# EAGLE design IOIO (EAGLE 6.3)
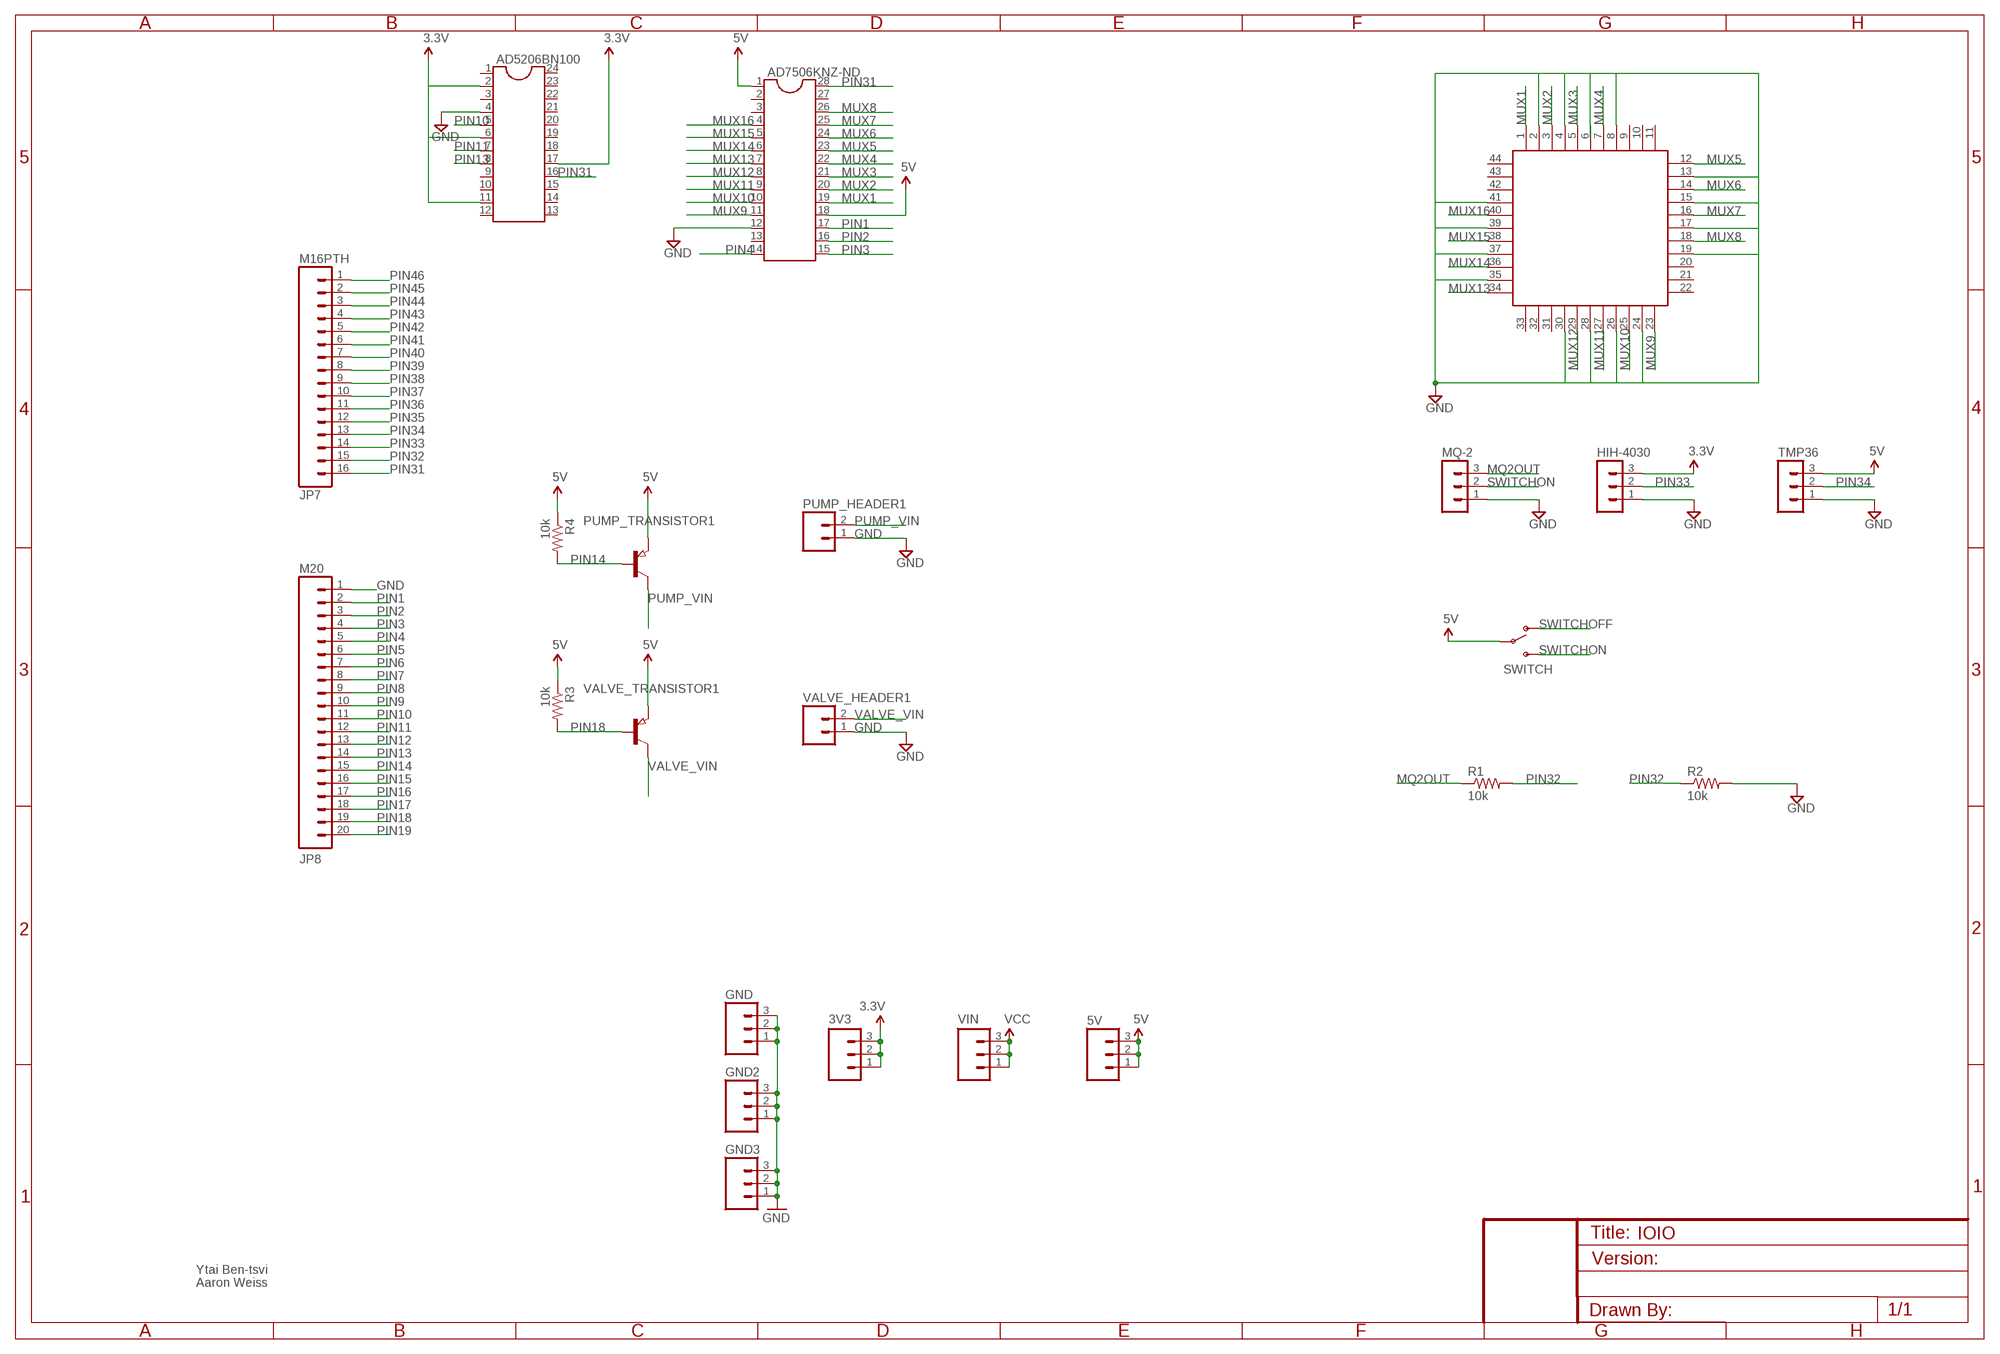
[diagram p0: schematic, sheet 1]

## Parts
3V3  M03PTH  [1X03]
5V  M03PTH  [1X03]
AD5206BN100  DIL24-3  [DIL24-3]
AD7506KNZ-ND  DIL28  [DIL28-6]
GND  M03PTH  [1X03]
GND2  M03PTH  [1X03]
GND3  M03PTH  [1X03]
HIH-4030  MA03-1  [MA03-1]
JP7  M16PTH  [1X16]
JP8  M20  [1X20]
MQ-2  MA03-1  [MA03-1]
PUMP_HEADER1  M02PTH  [1X02]
PUMP_TRANSISTOR1  PNP-TRANSISTOR_SOT23  [SOT23]
R1  10k  R-US_0207/7  [0207/7]
R2  10k  R-US_0207/7  [0207/7]
R3  10k  R-US_M2012  [M2012]
R4  10k  R-US_M2012  [M2012]
SWITCH  SWITCH-SPSTPTH  [SWITCH-SPDT]
TMP36  MA03-1  [MA03-1]
U$1  S44  [S44]
VALVE_HEADER1  M02PTH  [1X02]
VALVE_TRANSISTOR1  PNP-TRANSISTOR_SOT23  [SOT23]
VIN  M03PTH  [1X03]

## Nets
3.3V: 3V3.1 3V3.2 3V3.3 AD5206BN100.2 AD5206BN100.6 AD5206BN100.11 AD5206BN100.17 HIH-4030.3
5V: 5V.1 5V.2 5V.3 AD7506KNZ-ND.1 AD7506KNZ-ND.18 PUMP_TRANSISTOR1.2(E) R3.1 R4.1 SWITCH.2(P) TMP36.3 VALVE_TRANSISTOR1.2(E)
GND: AD5206BN100.4 AD7506KNZ-ND.12 GND2.1 GND2.2 GND2.3 GND3.1 GND3.2 GND3.3 GND.1 GND.2 GND.3 HIH-4030.1 JP8.1 MQ-2.1 PUMP_HEADER1.1 R2.2 TMP36.1 U$1.2 U$1.4 U$1.8 U$1.13 U$1.15 U$1.17 U$1.19 U$1.24 U$1.26 U$1.28 U$1.30 U$1.35 U$1.37 U$1.39 U$1.41 VALVE_HEADER1.1
MQ2OUT: MQ-2.3 R1.1
MUX1: AD7506KNZ-ND.19 U$1.1
MUX2: AD7506KNZ-ND.20 U$1.3
MUX3: AD7506KNZ-ND.21 U$1.5
MUX4: AD7506KNZ-ND.22 U$1.7
MUX5: AD7506KNZ-ND.23 U$1.12
MUX6: AD7506KNZ-ND.24 U$1.14
MUX7: AD7506KNZ-ND.25 U$1.16
MUX8: AD7506KNZ-ND.26 U$1.18
MUX9: AD7506KNZ-ND.11 U$1.23
MUX10: AD7506KNZ-ND.10 U$1.25
MUX11: AD7506KNZ-ND.9 U$1.27
MUX12: AD7506KNZ-ND.8 U$1.29
MUX13: AD7506KNZ-ND.7 U$1.34
MUX14: AD7506KNZ-ND.6 U$1.36
MUX15: AD7506KNZ-ND.5 U$1.38
MUX16: AD7506KNZ-ND.4 U$1.40
PIN1: AD7506KNZ-ND.17 JP8.2
PIN2: AD7506KNZ-ND.16 JP8.3
PIN3: AD7506KNZ-ND.15 JP8.4
PIN4: AD7506KNZ-ND.14 JP8.5
PIN5: JP8.6
PIN6: JP8.7
PIN7: JP8.8
PIN8: JP8.9
PIN9: JP8.10
PIN10: AD5206BN100.5 JP8.11
PIN11: AD5206BN100.7 JP8.12
PIN12: JP8.13
PIN13: AD5206BN100.8 JP8.14
PIN14: JP8.15 PUMP_TRANSISTOR1.1(B) R4.2
PIN15: JP8.16
PIN16: JP8.17
PIN17: JP8.18
PIN18: JP8.19 R3.2 VALVE_TRANSISTOR1.1(B)
PIN19: JP8.20
PIN31: AD5206BN100.16 AD7506KNZ-ND.28 JP7.16
PIN32: JP7.15 R1.2 R2.1
PIN33: HIH-4030.2 JP7.14
PIN34: JP7.13 TMP36.2
PIN35: JP7.12
PIN36: JP7.11
PIN37: JP7.10
PIN38: JP7.9
PIN39: JP7.8
PIN40: JP7.7
PIN41: JP7.6
PIN42: JP7.5
PIN43: JP7.4
PIN44: JP7.3
PIN45: JP7.2
PIN46: JP7.1
PUMP_VIN: PUMP_HEADER1.2 PUMP_TRANSISTOR1.3(C)
SWITCHOFF: SWITCH.1(O)
SWITCHON: MQ-2.2 SWITCH.3(S)
VALVE_VIN: VALVE_HEADER1.2 VALVE_TRANSISTOR1.3(C)
VCC: VIN.1 VIN.2 VIN.3
Unconnected: AD5206BN100.1 AD5206BN100.3 AD5206BN100.9 AD5206BN100.10 AD5206BN100.12 AD5206BN100.13 AD5206BN100.14 AD5206BN100.15 AD5206BN100.18 AD5206BN100.19 AD5206BN100.20 AD5206BN100.21 AD5206BN100.22 AD5206BN100.23 AD5206BN100.24 AD7506KNZ-ND.2 AD7506KNZ-ND.3 AD7506KNZ-ND.13 AD7506KNZ-ND.27 U$1.6 U$1.9 U$1.10 U$1.11 U$1.20 U$1.21 U$1.22 U$1.31 U$1.32 U$1.33 U$1.42 U$1.43 U$1.44

## Notes on the sheet
- Ytai Ben-tsvi
- Aaron Weiss

## Library data of the parts
3V3 5V GND GND2 GND3 VIN = SparkFun:M03: Header 3 Standard 3-pin 0.1" header. Use with straight break away headers (SKU : PRT-00116), right angle break away headers (PRT-00553), swiss pins (PRT-00743), machine pins (PRT-00117), and female headers (PRT-00115). Molex polarized connector foot print use with SKU : PRT-08232 with associated crimp pins and housings.
AD5206BN100 = ic-package:DIL24: Dual In Line
AD7506KNZ-ND = ic-package:DIL28: Dual In Line
HIH-4030 MQ-2 TMP36 = con-lstb:MA03-1: PIN HEADER; OC_FARNELL: unknown; OC_NEWARK: unknown
JP7 = SparkFun-Connectors:M16: 1x16 .1" header
JP8 = SparkFun-Connectors:M20: 1x20 .1" header This is just like the LOCK variant in that the holes are staggared by 5 mil, but except for the last two holes. They are not altered from the "standard" footprint layout. This is used for a special purpose on the layout of our Graphic LCD Backpack. Make sure you want to use this device before selecting it for you project!
PUMP_HEADER1 VALVE_HEADER1 = SparkFun:M02: Header 2 Standard 2-pin 0.1" header. Use with straight break away headers (SKU : PRT-00116), right angle break away headers (PRT-00553), swiss pins (PRT-00743), machine pins (PRT-00117), and female headers (PRT-00115). Molex polarized connector foot print use with SKU : PRT-08233 with associated crimp pins and housings.
PUMP_TRANSISTOR1 VALVE_TRANSISTOR1 = semicon-smd-ipc:PNP-TRANSISTOR_: PNP TRANSISTOR
R1-R4 = rcl:R-US_: RESISTOR, American symbol
SWITCH = SparkFun:SWITCH-SPST: SPST Switch Simple slide switch. Spark Fun Electronics SKU : COM-00102
U$1 = plcc-socket:S44: 44-pin PLCC through-hole socket

## Board
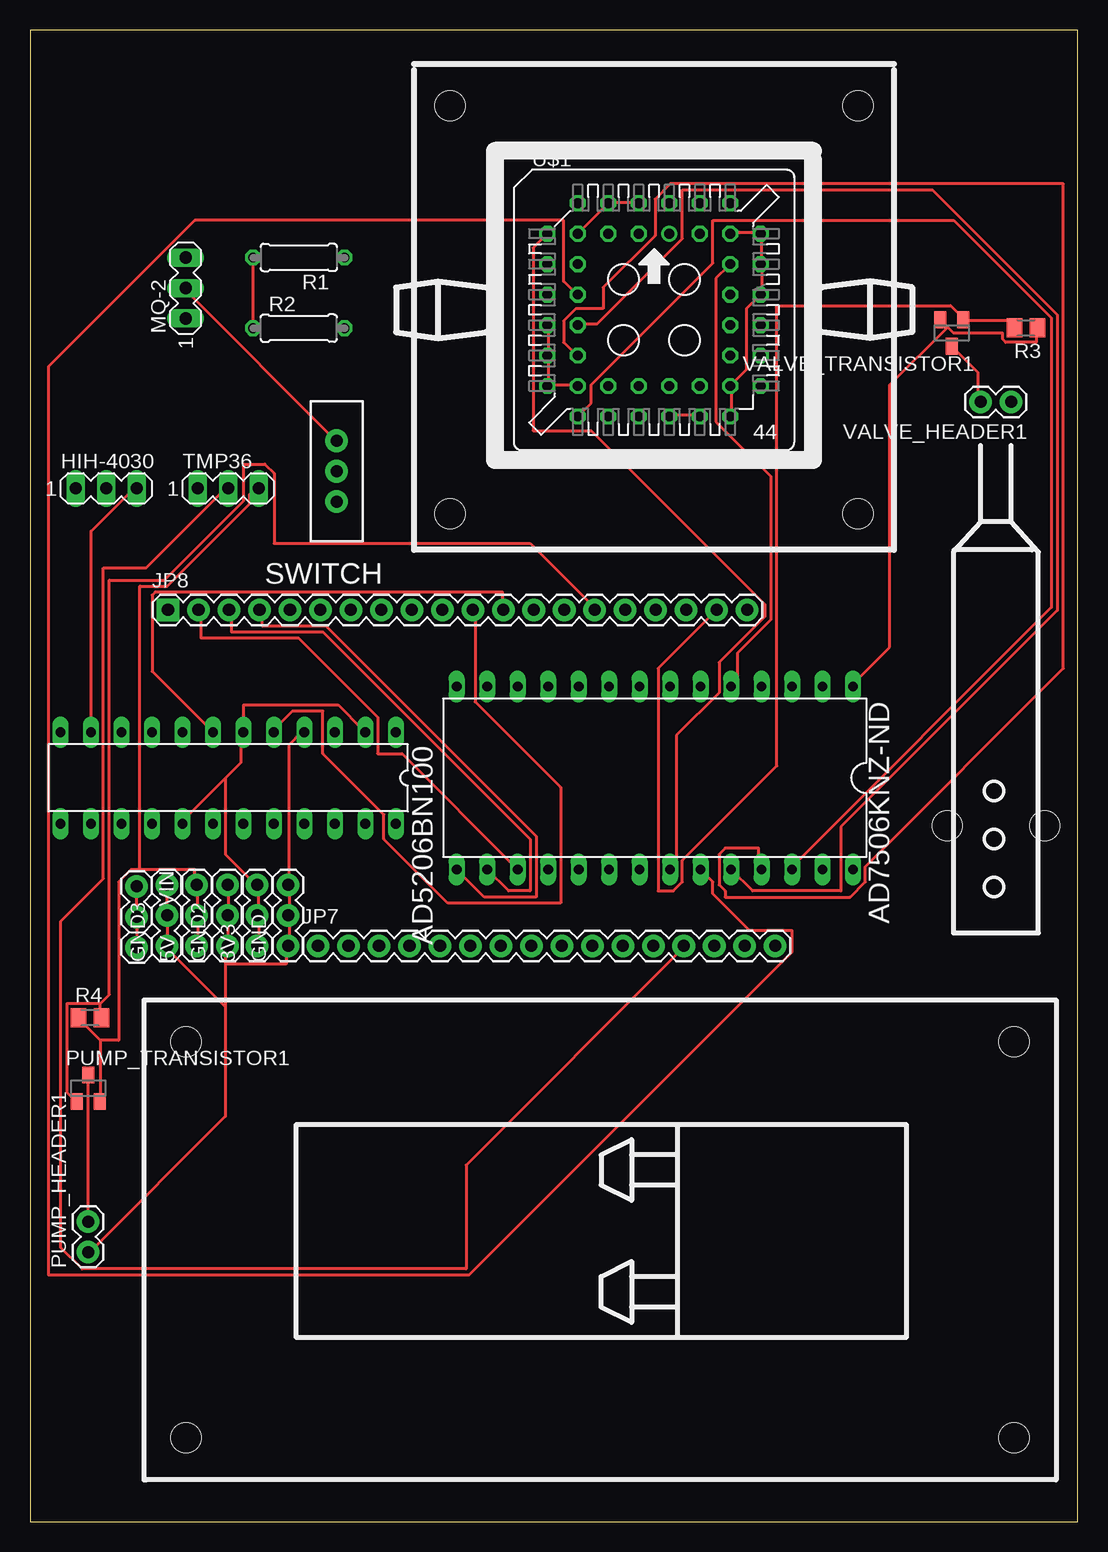
[diagram p1: board, top side]
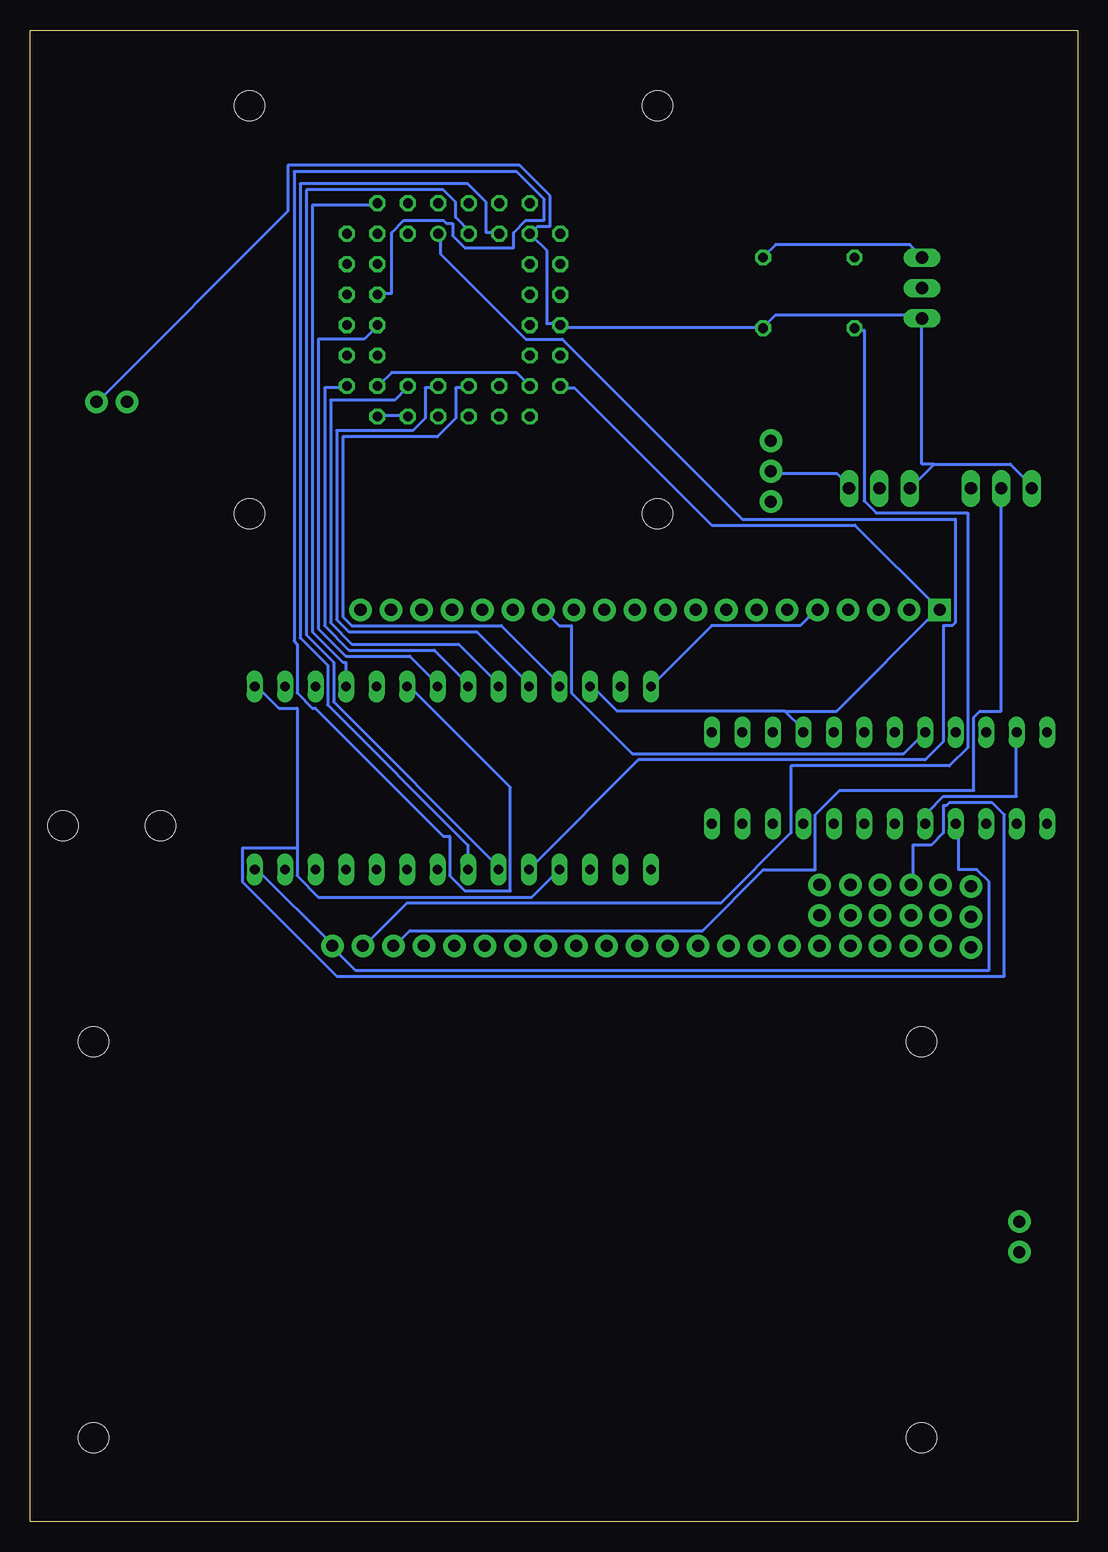
[diagram p2: board, bottom side, seen from below]

Size 87.3 x 124.32 mm. Coordinates in mm from the lower left corner, seen from the top.
Outline: 0,0 87.3,0 87.3,124.32 0,124.32 0,0
Copper layers (1*16): Top 0.035mm / dielectric 1.5mm / Bottom 0.035mm
Design rules "default": minimum track width 10mil, minimum drill 24mil, track to track 8mil, track to pad 8mil, pad to pad 8mil, via to via 8mil, smd to smd 8mil, copper to edge 40mil, drill to drill 8mil, minimum pad ring 10mil, minimum via ring 8mil, stop-mask expansion 4mil, vias tented up to drill 0mil, thermal gap 10mil
Holes 2.5 mm at 84.55,58 76.43,58 35,118 69,118 69,84 35,84 82,40 82,7 13,7 13,40

### Footprints (pad centres in the part's own frame; a part is rotated, then mirrored left to right if it is on the bottom)
1X03 = drill 1.016 pad 1.88: 1 0,0; 2 2.54,0; 3 5.08,0
DIL24-3 = drill 0.813 long: 1 -13.97,-3.81; 2 -11.43,-3.81; 3 -8.89,-3.81; 4 -6.35,-3.81; 5 -3.81,-3.81; 6 -1.27,-3.81; 7 1.27,-3.81; 8 3.81,-3.81; 9 6.35,-3.81; 10 8.89,-3.81; 11 11.43,-3.81; 12 13.97,-3.81; 13 13.97,3.81; 14 11.43,3.81; 15 8.89,3.81; 16 6.35,3.81; 17 3.81,3.81; 18 1.27,3.81; 19 -1.27,3.81; 20 -3.81,3.81; 21 -6.35,3.81; 22 -8.89,3.81; 23 -11.43,3.81; 24 -13.97,3.81
DIL28-6 = drill 0.813 long: 1 -16.51,-7.62; 2 -13.97,-7.62; 3 -11.43,-7.62; 4 -8.89,-7.62; 5 -6.35,-7.62; 6 -3.81,-7.62; 7 -1.27,-7.62; 8 1.27,-7.62; 9 3.81,-7.62; 10 6.35,-7.62; 11 8.89,-7.62; 12 11.43,-7.62; 13 13.97,-7.62; 14 16.51,-7.62; 15 16.51,7.62; 16 13.97,7.62; 17 11.43,7.62; 18 8.89,7.62; 19 6.35,7.62; 20 3.81,7.62; 21 1.27,7.62; 22 -1.27,7.62; 23 -3.81,7.62; 24 -6.35,7.62; 25 -8.89,7.62; 26 -11.43,7.62; 27 -13.97,7.62; 28 -16.51,7.62
MA03-1 = drill 1.016 long: 1 -2.54,0; 2 0,0; 3 2.54,0
1X16 = drill 1.016 pad 1.88: 1 0,0; 2 2.54,0; 3 5.08,0; 4 7.62,0; 5 10.16,0; 6 12.7,0; 7 15.24,0; 8 17.78,0; 9 20.32,0; 10 22.86,0; 11 25.4,0; 12 27.94,0; 13 30.48,0; 14 33.02,0; 15 35.56,0; 16 38.1,0
1X20 = drill 1.016 pad 1.88 square: 1 0,0 | drill 1.016 pad 1.88: 2 2.54,0; 3 5.08,0; 4 7.62,0; 5 10.16,0; 6 12.7,0; 7 15.24,0; 8 17.78,0; 9 20.32,0; 10 22.86,0; 11 25.4,0; 12 27.94,0; 13 30.48,0; 14 33.02,0; 15 35.56,0; 16 38.1,0; 17 40.64,0; 18 43.18,0; 19 45.72,0; 20 48.26,0
1X02 = drill 1.016 pad 1.88: 1 0,0; 2 2.54,0
SOT23 = smd 1 x 1.4: 1 -0.95,-1.1; 2 0.95,-1.1; 3 0,1.1
0207/7 = drill 0.813 octagon: 1 -3.81,0; 2 3.81,0
M2012 = smd 1.3 x 1.6: 1 -0.95,0; 2 0.95,0
SWITCH-SPDT = drill 1.016 pad 1.88: 1 0,2.54; 2 0,0; 3 0,-2.54
S44 = drill 0.813: 1 1.27,6.35 | drill 0.813 octagon: 2 -1.27,8.89; 3 -1.27,6.35; 4 -3.81,8.89; 5 -3.81,6.35; 6 -6.35,8.89; 7 -8.89,6.35; 8 -6.35,6.35; 9 -8.89,3.81; 10 -6.35,3.81; 11 -8.89,1.27; 12 -6.35,1.27; 13 -8.89,-1.27; 14 -6.35,-1.27; 15 -8.89,-3.81; 16 -6.35,-3.81; 17 -8.89,-6.35; 18 -6.35,-8.89; 19 -6.35,-6.35; 20 -3.81,-8.89; 21 -3.81,-6.35; 22 -1.27,-8.89; 23 -1.27,-6.35; 24 1.27,-8.89; 25 1.27,-6.35; 26 3.81,-8.89; 27 3.81,-6.35; 28 6.35,-8.89; 29 8.89,-6.35; 30 6.35,-6.35; 31 8.89,-3.81; 32 6.35,-3.81; 33 8.89,-1.27; 34 6.35,-1.27; 35 8.89,1.27; 36 6.35,1.27; 37 8.89,3.81; 38 6.35,3.81; 39 8.89,6.35; 40 6.35,8.89; 41 6.35,6.35; 42 3.81,8.89; 43 3.81,6.35; 44 1.27,8.89

### Placement (x,y rotation side)
3V3  18.93,48 90 top
5V  13.89,48 90 top
AD5206BN100  16.51,61.99 180 top
AD7506KNZ-ND  52.07,61.99 180 top
GND  21.51,48 90 top
GND2  16.47,48 90 top
GND3  11.43,48 90 top
HIH-4030  6.35,86.12 0 top
JP7  24,48 0 top
JP8  11.5,76 0 top
MQ-2  12.97,102.82 90 top
PUMP_HEADER1  4.85,22.47 90 top
PUMP_TRANSISTOR1  4.85,36.13 0 top
R1  22.4,105.36 180 top
R2  22.4,99.47 0 top
R3  83,99.5 180 top
R4  5,42 0 top
SWITCH  25.56,87.55 180 top
TMP36  16.51,86.12 0 top
U$1  52,101 0 top
VALVE_HEADER1  81.76,93.33 180 top
VALVE_TRANSISTOR1  76.8,99.07 180 top
VIN  8.89,52.96 270 top

### Tracks (layer width: path | path; a pad name or v marks a point on that pad's centre or on a via)
3.3V
  Top 0.254: 3V3.1 19.07,48.01 19.07,50.29 3V3.2 19.07,50.55 19.07,52.83 3V3.3 18.81,53.09 16.27,55.63 16.27,61.98 | 16.27,61.98 17.54,63.25 17.54,65.79 AD5206BN100.6 17.8,66.04 17.8,68.07 25.67,68.07 27.7,66.04 AD5206BN100.2 | 16.27,61.98 12.72,58.42 AD5206BN100.17 | HIH-4030.3 8.65,86.11 5.1,82.55 5.1,66.04 AD5206BN100.11
  Bottom 0.254: AD5206BN100.11 5.1,65.79 5.1,60.45 11.19,60.45 12.46,59.18 12.46,58.42 AD5206BN100.17
5V
  Top 0.254: 5.86,40.13 5.86,35.05 PUMP_TRANSISTOR1.2 | 5.86,40.13 4.08,41.91 R4.1 | 5V.1 13.99,48.01 13.99,50.29 5V.2 13.99,50.55 13.99,52.83 5V.3 13.73,53.09 13.73,54.36 9.16,54.36 | 5.86,40.13 7.38,40.13 7.38,53.34 8.4,54.36 9.16,54.36 | 9.16,54.36 9.16,77.98 11.45,77.98 18.3,84.84 18.3,85.6 18.81,86.11 TMP36.3 | 76.47,99.57 76.98,99.06 81.04,99.06 81.04,98.55 81.3,98.3 83.84,98.3 83.84,99.31 R3.1 | 76.47,99.57 75.96,100.08 VALVE_TRANSISTOR1.2 | 76.47,99.57 71.64,94.74 71.64,72.9 68.6,69.85 AD7506KNZ-ND.1
  Bottom 0.254: TMP36.3 19.07,86.36 20.08,87.38 25.42,87.38 SWITCH.2 | 65.04,56.13 65.04,67.82 66.56,67.82 68.34,69.6 AD7506KNZ-ND.1 | 65.04,56.13 65.04,53.85 63.26,52.07 45.48,52.07 43.2,54.36 AD7506KNZ-ND.18 | 65.04,56.13 69.61,56.13 69.61,53.34 61.74,45.47 6.11,45.47 6.11,58.93 7.13,59.94 10.68,59.94 10.94,59.69 11.19,59.69 11.19,57.4 12.21,56.39 13.73,56.39 13.73,53.09 5V.3
GND
  Top 0.254: GND3.3 11.45,52.83 11.45,50.55 GND3.2 11.45,50.29 11.45,48.01 GND3.1 11.45,47.75 16.27,42.93 | GND2.3 16.53,52.83 16.53,50.55 GND2.2 16.53,50.29 16.53,48.01 GND2.1 16.27,47.75 16.27,46.48 | 16.27,46.48 16.27,42.93 | 16.27,42.93 16.27,33.78 5.1,22.61 PUMP_HEADER1.1 | AD5206BN100.4 22.62,65.79 21.61,64.77 21.61,53.09 GND.3 21.61,52.83 21.61,50.55 GND.2 21.61,50.29 21.61,48.01 GND.1 21.35,47.75 21.35,46.48 16.27,46.48 | U$1.8 45.74,107.44 48.02,109.73 U$1.4 48.28,109.98 50.56,109.98 U$1.2 | U$1.24 53.36,92.2 55.64,92.2 U$1.26 | U$1.28 58.44,92.2 58.44,94.49 U$1.30 58.44,94.74 59.71,96.01 59.71,101.09 60.72,102.11 U$1.35 60.98,102.36 60.98,104.65 U$1.37 60.98,104.9 60.98,107.19 U$1.39 60.72,107.44 58.44,107.44 U$1.41 | 43.2,94.74 43.2,97.03 U$1.15 43.2,97.28 43.2,99.57 U$1.13 | 43.2,94.74 45.48,94.74 U$1.19 | 43.2,94.74 U$1.17
  Bottom 0.254: 24.4,67.56 38.37,67.56 40.4,69.6 AD7506KNZ-ND.12 | 24.4,67.56 22.88,66.04 AD5206BN100.4 | 24.4,67.56 20.08,67.56 11.7,75.95 JP8.1 18.56,83.06 30.5,83.06 41.93,94.49 42.94,94.49 U$1.17 | VALVE_HEADER1.1 81.55,93.47 65.8,109.22 65.8,113.03 46.5,113.03 43.96,110.49 43.96,107.95 44.97,107.95 45.48,107.44 U$1.8 45.48,107.19 44.21,105.92 44.21,99.82 43.2,99.82 U$1.13 42.94,99.57 26.43,99.57 R2.2 26.18,99.57 25.16,100.58 13.22,100.58 12.97,100.33 MQ-2.1 12.97,88.14 11.95,88.14 | 11.95,88.14 5.6,88.14 3.83,86.36 HIH-4030.1 | 11.95,88.14 13.73,86.36 TMP36.1 | U$1.26 55.9,92.2 58.18,92.2 U$1.28 | U$1.30 58.18,94.74 57.17,95.76 46.75,95.76 45.74,94.74 U$1.19
MQ2OUT
  Bottom 0.254: R1.1 26.18,105.41 25.16,106.43 13.99,106.43 12.97,105.41 MQ-2.3
MUX1
  Bottom 0.254: AD7506KNZ-ND.19 45.48,54.61 36.59,63.5 12.72,63.5 11.19,65.02 11.19,74.68 10.43,74.68 10.18,74.93 10.18,83.57 27.96,83.57 42.94,98.55 45.99,98.55 53.1,105.66 53.1,107.19 U$1.1
MUX2
  Bottom 0.254: AD7506KNZ-ND.20 48.28,54.61 61.99,68.33 61.99,71.63 64.28,73.91 64.28,111 52.85,111 51.83,109.98 51.83,108.71 50.56,107.44 U$1.3
MUX3
  Bottom 0.254: AD7506KNZ-ND.21 50.82,54.61 50.82,56.39 62.5,68.07 62.5,71.37 64.79,73.66 64.79,111.51 50.82,111.51 49.29,109.98 49.29,107.44 48.28,107.44 U$1.5
MUX4
  Top 0.254: AD7506KNZ-ND.22 53.36,54.61 53.86,55.12 53.86,65.53 57.42,69.09 57.42,71.63 61.23,75.44 61.23,76.45 46.75,90.93 41.93,90.93 41.93,106.17 42.94,107.19 U$1.7
MUX5
  Top 0.254: AD7506KNZ-ND.23 55.9,54.36 56.91,53.34 56.91,52.32 59.96,49.28 63.52,49.28 63.52,47.5 36.59,20.57 1.54,20.57 1.54,96.27 13.73,108.46 44.47,108.46 44.47,103.38 45.48,102.36 U$1.12
MUX6
  Top 0.254: AD7506KNZ-ND.24 58.44,54.36 60.21,52.58 67.58,52.58 67.58,57.91 85.61,75.95 85.61,100.58 75.2,111 54.37,111 54.37,106.93 47.26,99.82 45.74,99.82 U$1.14
MUX7
  Top 0.254: U$1.16 45.48,97.28 44.47,98.3 44.47,100.08 45.48,101.09 47.77,101.09 47.77,102.87 52.09,107.19 52.09,110.24 53.36,111.51 86.12,111.51 86.12,71.12 69.61,54.61 69.61,53.34 68.34,52.07 57.93,52.07 57.93,52.58 57.42,53.09 57.42,55.63 57.93,56.13 60.72,56.13 60.72,54.61 AD7506KNZ-ND.25
MUX8
  Top 0.254: AD7506KNZ-ND.26 63.52,54.61 85.11,76.2 85.11,100.33 76.98,108.46 56.91,108.46 56.91,104.9 46.75,94.74 46.75,93.22 45.74,92.2 U$1.18
MUX9
  Bottom 0.254: AD7506KNZ-ND.11 43.2,69.85 48.02,74.68 60.47,74.68 61.23,75.44 61.23,90.42 53.36,90.42 51.83,91.95 51.83,94.49 50.82,94.49 U$1.23
MUX10
  Bottom 0.254: AD7506KNZ-ND.10 45.74,69.85 50.05,74.17 60.72,74.17 61.74,75.18 61.74,90.93 55.39,90.93 54.37,91.95 54.37,94.49 53.36,94.49 U$1.25
MUX11
  Bottom 0.254: AD7506KNZ-ND.9 48.28,69.85 51.58,73.15 60.47,73.15 62.25,74.93 62.25,93.47 56.91,93.47 55.9,94.49 U$1.27
MUX12
  Bottom 0.254: AD7506KNZ-ND.8 50.82,69.85 53.61,72.64 60.72,72.64 62.75,74.68 62.75,94.49 60.98,94.49 U$1.29
MUX13
  Bottom 0.254: AD7506KNZ-ND.7 53.36,69.85 55.64,72.14 60.98,72.14 63.26,74.42 63.26,98.55 59.45,98.55 58.44,99.57 U$1.34
MUX14
  Bottom 0.254: AD7506KNZ-ND.6 55.64,69.6 47.26,61.21 47.26,52.58 51.07,52.58 52.34,53.85 52.34,57.15 52.85,57.15 63.52,67.82 63.77,67.82 65.04,69.09 65.04,73.15 65.29,73.41 65.29,112.52 46.75,112.52 44.47,110.24 44.47,108.46 45.99,108.46 47.01,107.44 47.01,106.17 51.07,106.17 52.09,107.19 52.09,108.2 52.59,108.2 52.85,108.46 56.15,108.46 57.17,107.44 57.17,102.36 58.18,102.36 U$1.36
MUX15
  Top 0.254: AD7506KNZ-ND.5 58.44,69.85 58.94,70.36 58.94,72.39 61.74,75.18 61.74,87.12 57.17,91.69 57.17,103.63 58.18,104.65 U$1.38
MUX16
  Bottom 0.254: AD7506KNZ-ND.4 60.98,69.85 60.98,71.63 61.23,71.63 63.77,74.17 63.77,109.73 58.44,109.73 U$1.40
PIN1
  Top 0.254: AD7506KNZ-ND.17 40.4,54.61 31,64.01 28.97,64.01 28.97,67.06 22.37,73.66 14.24,73.66 14.24,75.95 JP8.2
PIN2
  Top 0.254: AD7506KNZ-ND.16 38.12,54.36 39.89,52.58 41.67,52.58 41.67,56.9 24.4,74.17 16.78,74.17 16.78,75.95 JP8.3
PIN3
  Top 0.254: AD7506KNZ-ND.15 35.58,54.36 37.86,52.07 42.18,52.07 42.18,57.15 24.65,74.68 19.32,74.68 19.32,75.95 JP8.4
PIN4
  Bottom 0.254: AD7506KNZ-ND.14 35.32,69.85 30.5,74.68 23.13,74.68 21.86,75.95 JP8.5
PIN10
  Top 0.254: AD5206BN100.5 20.34,66.04 21.86,67.56 24.4,67.56 24.4,64.01 29.48,58.93 29.48,56.9 34.81,51.56 44.21,51.56 44.21,61.21 37.1,68.33 37.1,75.95 JP8.11
PIN11
  Top 0.254: AD5206BN100.7 15,66.04 10.18,70.87 10.18,77.22 10.43,77.47 39.39,77.47 39.39,76.2 JP8.12
PIN13
  Bottom 0.254: JP8.14 43.2,74.68 42.18,74.68 42.18,69.09 37.1,64.01 14.49,64.01 12.72,65.79 AD5206BN100.8
PIN14
  Top 0.254: 5.86,43.18 3.06,43.18 3.06,35.81 3.83,35.05 PUMP_TRANSISTOR1.1 | 5.86,43.18 5.86,42.16 R4.2 | 5.86,43.18 6.62,43.94 6.62,78.49 11.19,78.49 17.8,85.09 17.8,88.14 19.57,88.14 20.34,87.38 20.34,81.53 41.67,81.53 47.01,76.2 JP8.15
PIN18
  Top 0.254: R3.2 81.8,99.57 81.8,100.08 77.99,100.08 VALVE_TRANSISTOR1.1 77.74,100.33 76.72,101.35 62.25,101.35 62.25,62.99 54.37,55.12 54.37,53.34 53.61,52.58 52.34,52.58 52.34,71.12 JP8.19
PIN31
  Bottom 0.254: AD7506KNZ-ND.28 68.34,54.36 61.99,48.01 JP7.16 61.99,47.75 60.21,45.97 7.38,45.97 7.38,53.34 8.4,54.36 9.92,54.36 9.92,58.17 AD5206BN100.16
PIN32
  Top 0.254: R2.1 18.56,99.57 18.56,105.16 R1.2
  Bottom 0.254: JP7.15 59.45,48.01 55.9,51.56 29.73,51.56 23.89,57.4 23.89,62.99 10.68,62.99 9.16,64.52 9.16,84.07 16.78,84.07 17.8,85.09 17.8,99.31 18.56,99.31 R2.1
PIN33
  Bottom 0.254: HIH-4030.2 6.37,86.11 6.37,67.56 8.14,67.56 8.65,67.06 8.65,60.96 19.83,60.96 21.86,58.93 21.86,54.36 26.18,54.36 31.26,49.28 55.64,49.28 56.91,48.01 JP7.14
PIN34
  Top 0.254: TMP36.2 16.27,86.11 9.67,79.5 6.11,79.5 6.11,53.59 2.56,50.04 2.56,22.86 4.33,21.08 36.34,21.08 36.34,29.72 54.37,47.75 JP7.13
PUMP_VIN
  Top 0.254: PUMP_TRANSISTOR1.3 4.84,37.08 4.84,25.15 PUMP_HEADER1.2
SWITCHON
  Top 0.254: MQ-2.2 12.97,102.62 25.42,90.17 SWITCH.3
VALVE_VIN
  Top 0.254: VALVE_TRANSISTOR1.3 76.98,97.79 79.01,95.76 79.01,93.47 VALVE_HEADER1.2
VCC
  Top 0.254: VIN.3 8.91,48.01 8.91,50.29 VIN.2 8.91,50.55 8.91,52.83 VIN.1